# Altium schematic sheet 模拟量采集电路.SchDoc
size A4; SheetNumber: 6; SheetTotal: 6
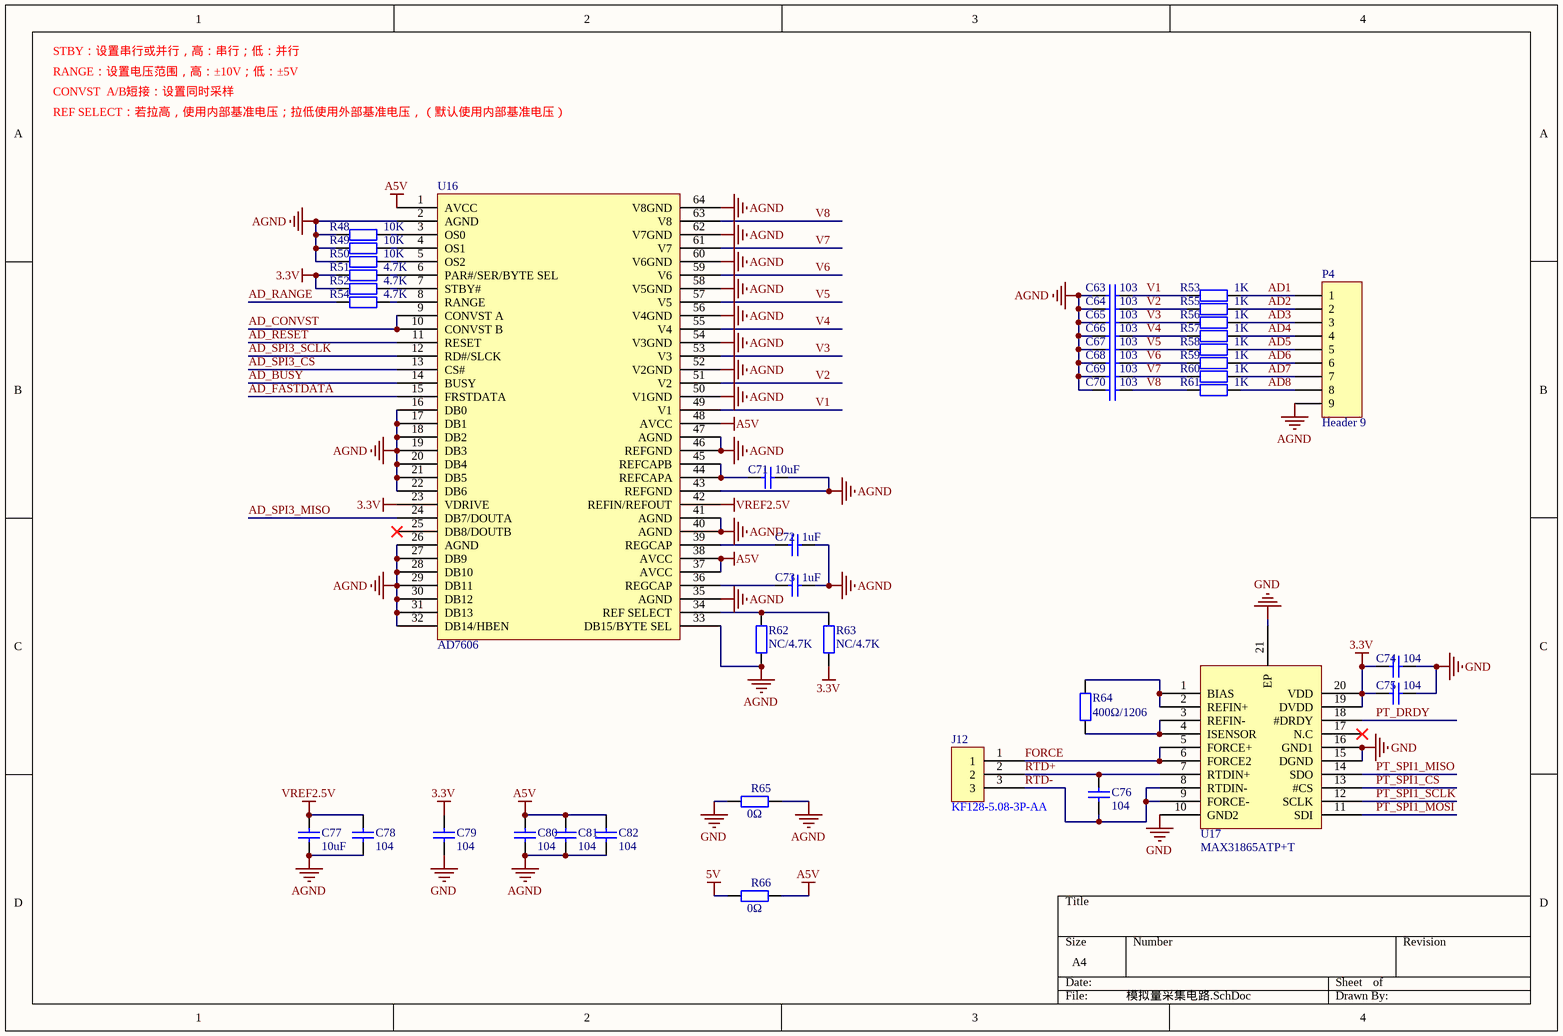
[diagram p0: 模拟量采集电路.SchDoc]

## Parts
C63  103  [C 0603_L]
C64  103  [C 0603_L]
C65  103  [C 0603_L]
C66  103  [C 0603_L]
C67  103  [C 0603_L]
C68  103  [C 0603_L]
C69  103  [C 0603_L]
C70  103  [C 0603_L]
C71  10uF  [C 0603_L]
C72  1uF  [C 0603_L]
C73  1uF  [C 0603_L]
C74  104  [C 0603_L]
C75  104  [C 0603_L]
C76  104  [C 0603_L]
C77  10uF  [C 0603_L]
C78  104  [C 0603_L]
C79  104  [C 0603_L]
C80  104  [C 0603_L]
C81  104  [C 0603_L]
C82  104  [C 0603_L]
J12  KF128-5.08-3P-AA  [KF128-5.08-3P]
P4  Header 9  [KF128-5.08-9P]
R48  10K  [R 0603_L]
R49  10K  [R 0603_L]
R50  10K  [R 0603_L]
R51  4.7K  [R 0603_L]
R52  4.7K  [R 0603_L]
R53  1K  [R 0603_L]
R54  4.7K  [R 0603_L]
R55  1K  [R 0603_L]
R56  1K  [R 0603_L]
R57  1K  [R 0603_L]
R58  1K  [R 0603_L]
R59  1K  [R 0603_L]
R60  1K  [R 0603_L]
R61  1K  [R 0603_L]
R62  NC/4.7K  [R 0603_L]
R63  NC/4.7K  [R 0603_L]
R64  400Ω/1206  [R1206_L]
R65  0Ω  [R 0603_L]
R66  0Ω  [R 0603_L]
U16  AD7606  [LQFP64 10x10_M]
U17  MAX31865ATP+T  [QFN-20_L5.0-W5.0-P0.65-BL-EP]

## Nets
3.3V: C74.2 C75.2 C79.2 R51.2 R52.2 R63.2 U16.23(VDRIVE) U17.19(DVDD) U17.20(VDD)
5V: R66.1
A5V: C80.2 C81.2 C82.2 R66.2 U16.1(AVCC) U16.37(AVCC) U16.38(AVCC) U16.48(AVCC)
AGND: C63.2 C64.2 C65.2 C66.2 C67.2 C68.2 C69.2 C70.2 C71.1 C72.1 C73.1 C77.2 C78.1 C80.1 C81.1 C82.1 P4.9 R48.2 R49.2 R50.2 R62.2 R65.2 U16.2(AGND) U16.16(DB0) U16.17(DB1) U16.18(DB2) U16.19(DB3) U16.20(DB4) U16.21(DB5) U16.22(DB6) U16.26(AGND) U16.27(DB9) U16.28(DB10) U16.29(DB11) U16.30(DB12) U16.31(DB13) U16.32(DB14/HBEN) U16.33(DB15/BYTE_SEL) U16.35(AGND) U16.40(AGND) U16.41(AGND) U16.43(REFGND) U16.46(REFGND) U16.47(AGND) U16.50(V1GND) U16.52(V2GND) U16.54(V3GND) U16.56(V4GND) U16.58(V5GND) U16.60(V6GND) U16.62(V7GND) U16.64(V8GND)
GND: C74.1 C75.1 C79.1 R65.1 U17.10(GND2) U17.15(DGND) U17.16(GND1) U17.21(EP)
VREF2.5V: C77.1 C78.2 U16.42(REFIN/REFOUT)
AD1: P4.1 R53.1
AD2: P4.2 R55.1
AD3: P4.3 R56.1
AD4: P4.4 R57.1
AD5: P4.5 R58.1
AD6: P4.6 R59.1
AD7: P4.7 R60.1
AD8: P4.8 R61.1
AD_BUSY: U16.14(BUSY)
AD_CONVST: U16.9(CONVST_A) U16.10(CONVST_B)
AD_FASTDATA: U16.15(FRSTDATA)
AD_RANGE: R54.2
AD_RESET: U16.11(RESET)
AD_SPI3_CS: U16.13(CS#)
AD_SPI3_MISO: U16.24(DB7/DOUTA)
AD_SPI3_SCLK: U16.12(RD#/SLCK)
FORCE: J12.1 U17.5(FORCE+) U17.6(FORCE2)
PT_DRDY: U17.18(#DRDY)
PT_SPI1_CS: U17.13(#CS)
PT_SPI1_MISO: U17.14(SDO)
PT_SPI1_MOSI: U17.11(SDI)
PT_SPI1_SCLK: U17.12(SCLK)
RTD+: C76.2 J12.2 U17.7(RTDIN+)
RTD-: C76.1 J12.3 U17.8(RTDIN-) U17.9(FORCE-)
V1: C63.1 R53.2 U16.49(V1)
V2: C64.1 R55.2 U16.51(V2)
V3: C65.1 R56.2 U16.53(V3)
V4: C66.1 R57.2 U16.55(V4)
V5: C67.1 R58.2 U16.57(V5)
V6: C68.1 R59.2 U16.59(V6)
V7: C69.1 R60.2 U16.61(V7)
V8: C70.1 R61.2 U16.63(V8)
NetC71_2: C71.2 U16.44(REFCAPA) U16.45(REFCAPB)
NetC72_2: C72.2 U16.39(REGCAP)
NetC73_2: C73.2 U16.36(REGCAP)
NetR48_1: R48.1 U16.3(OS0)
NetR49_1: R49.1 U16.4(OS1)
NetR50_1: R50.1 U16.5(OS2)
NetR51_1: R51.1 U16.6(PAR#/SER/BYTE_SEL)
NetR52_1: R52.1 U16.7(STBY#)
NetR54_1: R54.1 U16.8(RANGE)
NetR62_1: R62.1 R63.1 U16.34(REF_SELECT)
NetR64_1: R64.1 U17.1(BIAS) U17.2(REFIN+)
NetR64_2: R64.2 U17.3(REFIN-) U17.4(ISENSOR)

Not connected (* = marked no-connect by the designer): U16 25(DB8/DOUTB)*; U17 17(N.C)*

## Notes on the sheet
- STBY：设置串行或并行，高：串行；低：并行
- RANGE：设置电压范围，高：±10V；低：±5V
- CONVST  A/B短接：设置同时采样
- REF SELECT：若拉高，使用内部基准电压；拉低使用外部基准电压，（默认使用内部基准电压）

## Library data of the parts
C63-C82 = Cap: 0603贴片电容; Published: 8-Jun-2000; LatestRevisionDate: 17-Jul-2002; LatestRevisionNote: Re-released for DXP Platform.; PackageReference: RAD-0.3; Publisher: Altium Limited; PackageDescription: Radial Cap, Thru-Hole; 2 Leads; 0.3 in Pin Spacing
J12 = KF128-5.08-3P-AA: KF128-5.08-3P-AA端座; Manufacturer: KEFA(科发); Add into BOM: yes; Structure: 1x3P; Pitch: 5.08mm; Current Rating (Max): 24A; Voltage Rating (Max): 250V; Wire Gauge - AWG: 12~22; Wire Gauge - mm2: 2.5; Number of PINs Per Row: 3; Symbol: KF128-5.08-3P; Device: KF128-5.08-3P-AA; LCSC Part Name: 5.08mm 1x3P 排数:1 每排P数:3 直插; Supplier Part: C474953; Manufacturer Part: KF128-5.08-3P-AA; Supplier Footprint: 插件,P=5.08mm; JLCPCB Part Class: 扩展库; Datasheet: https://atta.szlcsc.com/upload/public/pdf/source/20230317/DADFED05827EAD48C1D5B8C3D4CF88F4.pdf; Supplier: LCSC; Convert to PCB: yes; Color: 绿色; Mounting Style: 直插; Number of Pins: 3P; Number of Rows: 1; Operating Temperature Range: -40℃~+105℃
P4 = Header 9: Header, 9-Pin; LatestRevisionDate: 17-Jul-2002; LatestRevisionNote: Re-released for DXP Platform.; Publisher: Altium Limited
R48-R66 = Res: 0603贴片电阻; BOM名称: 贴片电阻; 版权归属: 源创客; 学习资源: www.ooocke.com
U16 = AD7606: Add into BOM: yes; Symbol: AD7606; Device: AD7606; LCSC Part Name: AD7606; Supplier Part: C9900008332; Manufacturer Part: AD7606; Supplier Footprint: LQFP-64(10x10); JLCPCB Part Class: 扩展库; Supplier: LCSC; Convert to PCB: yes
U17 = MAX31865ATP+T: Manufacturer: ADI(亚德诺)/MAXIM(美信); Add into BOM: yes; Resolution(Bits): 15位; number of channels: 1; Voltage - Supply: 3V~3.6V; Interface: SPI; differential input: 是; Integral non - linearity: 1LSB; Clock Frequency: 5MHz; ADC architecture: Sigma-Delta; Quiescent Current (Iq): 1.5mA; Symbol: MAX31865ATP+T; Device: MAX31865ATP+T; LCSC Part Name: MAX31865ATP; Supplier Part: C118474; Manufacturer Part: MAX31865ATP+T; Supplier Footprint: QFN-20-EP(5x5); Datasheet: https://item.szlcsc.com/datasheet/MAX31865ATP%252BT/119740.html; Supplier: LCSC; Convert to PCB: yes; Sampling Rate: -; Operating Temperature: -40℃~+125℃